# EAGLE design ALLtheOtherLEDs (EAGLE 5.09)
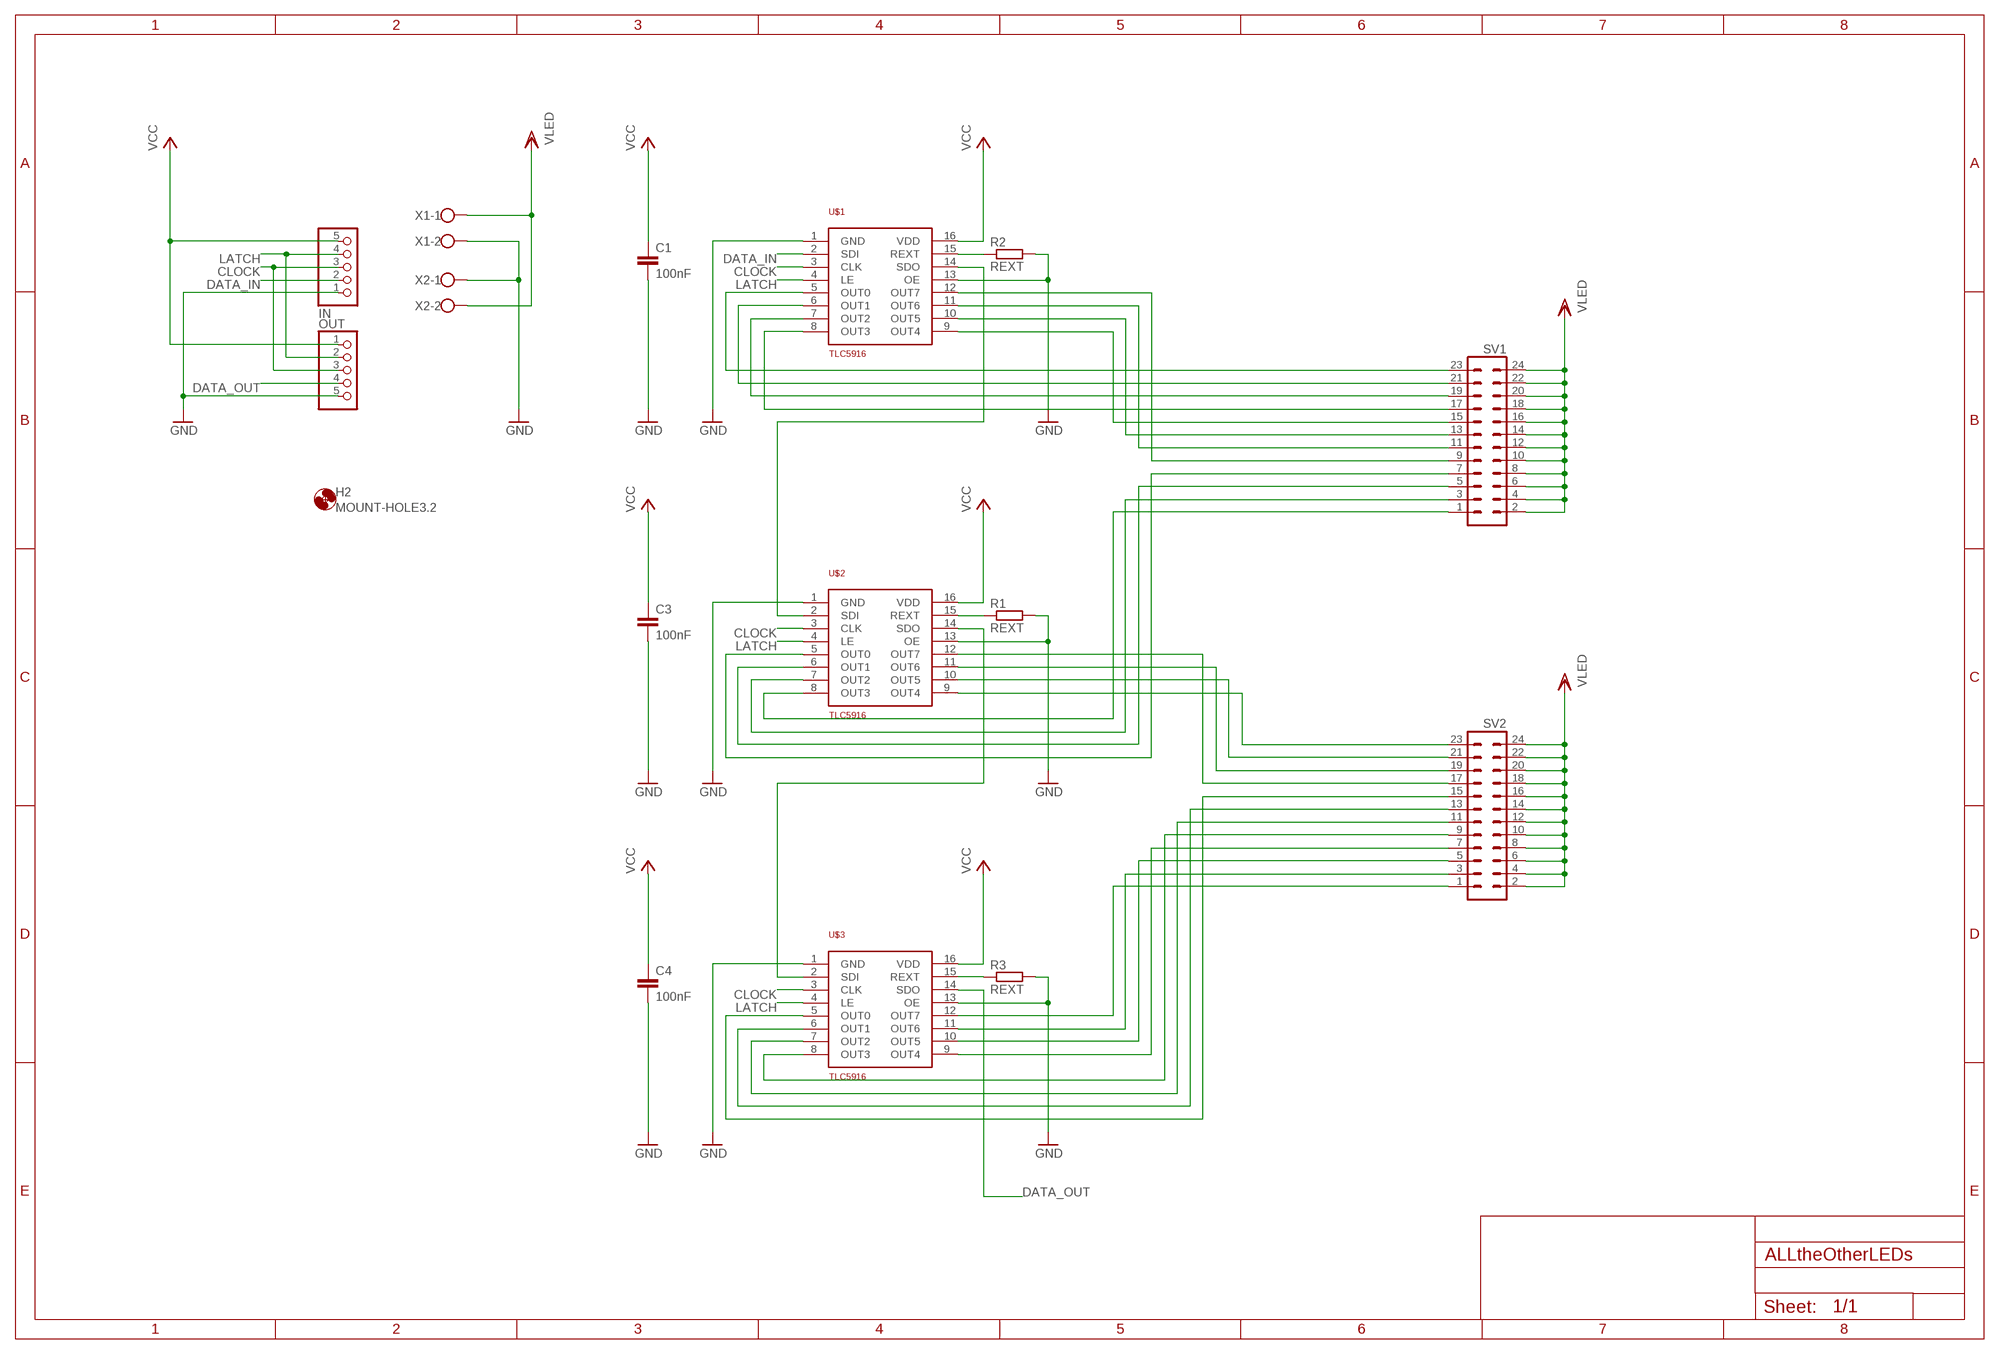
[diagram p0: schematic, sheet 1]

## Parts
C1  100nF  C-EU050-024X044  [C050-024X044]
C3  100nF  C-EU050-024X044  [C050-024X044]
C4  100nF  C-EU050-024X044  [C050-024X044]
H2  MOUNT-HOLE3.2  [3,2]
IN  PINHD-1X5/90  [1X05/90]
OUT  PINHD-1X5/90  [1X05/90]
R1  REXT  R-EU_0204/5  [0204/5]
R2  REXT  R-EU_0204/5  [0204/5]
R3  REXT  R-EU_0204/5  [0204/5]
SV1  MA12-2W  [MA12-2W]
SV2  MA12-2W  [MA12-2W]
U$1  TLC5916  [SO-16]
U$2  TLC5916  [SO-16]
U$3  TLC5916  [SO-16]
X1  W237-102  [W237-102]
X2  W237-102  [W237-102]

## Nets
CLOCK: IN.3 OUT.3 U$1.3(CLK) U$2.3(CLK) U$3.3(CLK)
DATA_IN: IN.2 U$1.2(SDI)
DATA_OUT: OUT.4 U$3.14(SDO)
GND: C1.2 C3.2 C4.2 IN.1 OUT.5 R1.2 R2.2 R3.2 U$1.1(GND) U$1.13(OE) U$2.1(GND) U$2.13(OE) U$3.1(GND) U$3.13(OE) X1.2 X2.1
LATCH: IN.4 OUT.2 U$1.4(LE) U$2.4(LE) U$3.4(LE)
N$1: U$2.14(SDO) U$3.2(SDI)
N$2: U$1.14(SDO) U$2.2(SDI)
N$4: R2.1 U$1.15(REXT)
N$5: R1.1 U$2.15(REXT)
N$6: SV1.23 U$1.5(OUT0)
N$7: R3.1 U$3.15(REXT)
N$8: SV1.21 U$1.6(OUT1)
N$29: SV1.19 U$1.7(OUT2)
N$30: SV1.17 U$1.8(OUT3)
N$31: SV1.15 U$1.9(OUT4)
N$32: SV1.13 U$1.10(OUT5)
N$33: SV1.11 U$1.11(OUT6)
N$34: SV1.9 U$1.12(OUT7)
N$35: SV1.1 U$2.8(OUT3)
N$36: SV1.7 U$2.5(OUT0)
N$37: SV1.5 U$2.6(OUT1)
N$38: SV1.3 U$2.7(OUT2)
N$39: SV2.1 U$3.12(OUT7)
N$40: SV2.3 U$3.11(OUT6)
N$41: SV2.5 U$3.10(OUT5)
N$42: SV2.7 U$3.9(OUT4)
N$43: SV2.9 U$3.8(OUT3)
N$44: SV2.11 U$3.7(OUT2)
N$45: SV2.13 U$3.6(OUT1)
N$46: SV2.15 U$3.5(OUT0)
N$47: SV2.17 U$2.12(OUT7)
N$48: SV2.19 U$2.11(OUT6)
N$49: SV2.21 U$2.10(OUT5)
N$50: SV2.23 U$2.9(OUT4)
VCC: C1.1 C3.1 C4.1 IN.5 OUT.1 U$1.16(VDD) U$2.16(VDD) U$3.16(VDD)
VSS: SV1.2 SV1.4 SV1.6 SV1.8 SV1.10 SV1.12 SV1.14 SV1.16 SV1.18 SV1.20 SV1.22 SV1.24 SV2.2 SV2.4 SV2.6 SV2.8 SV2.10 SV2.12 SV2.14 SV2.16 SV2.18 SV2.20 SV2.22 SV2.24 X1.1 X2.2 ; supply symbol labelled VLED

## Library data of the parts
C1 C3 C4 = rcl:C-EU: CAPACITOR, European symbol
H2 = holes:MOUNT-HOLE: MOUNTING HOLE with drill center marker
IN OUT = pinhead:PINHD-1X5: PIN HEADER
R1-R3 = rcl:R-EU_: RESISTOR, European symbol
SV1 SV2 = con-lstb:MA12-2W: PIN HEADER
U$1-U$3 = texas:TLC5916
X1 X2 = con-wago-500:W237-102: WAGO SCREW CLAMP

## Board
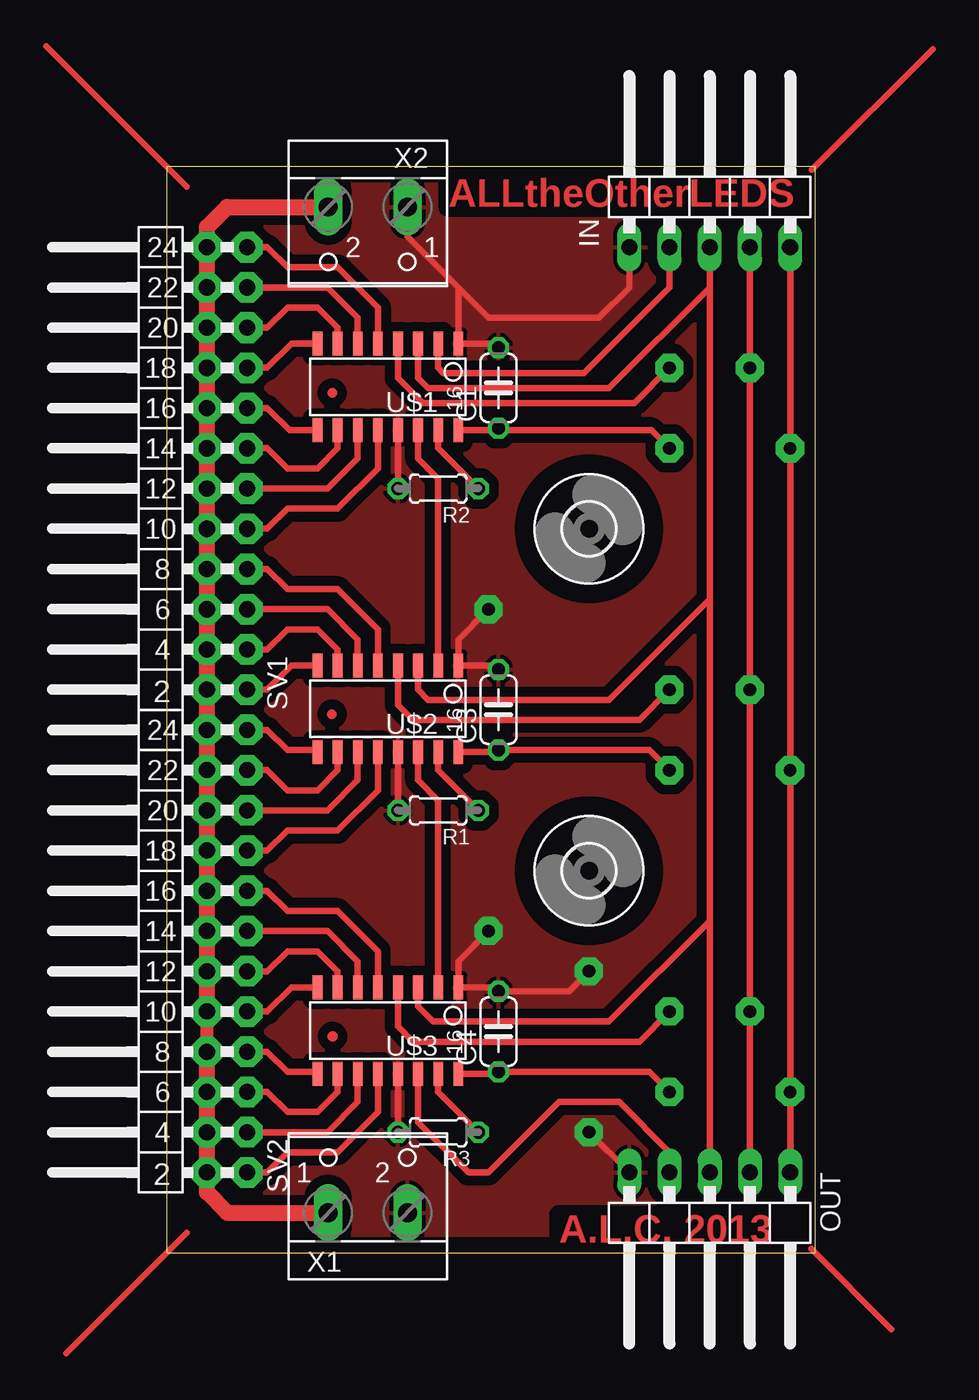
[diagram p1: board, top side]
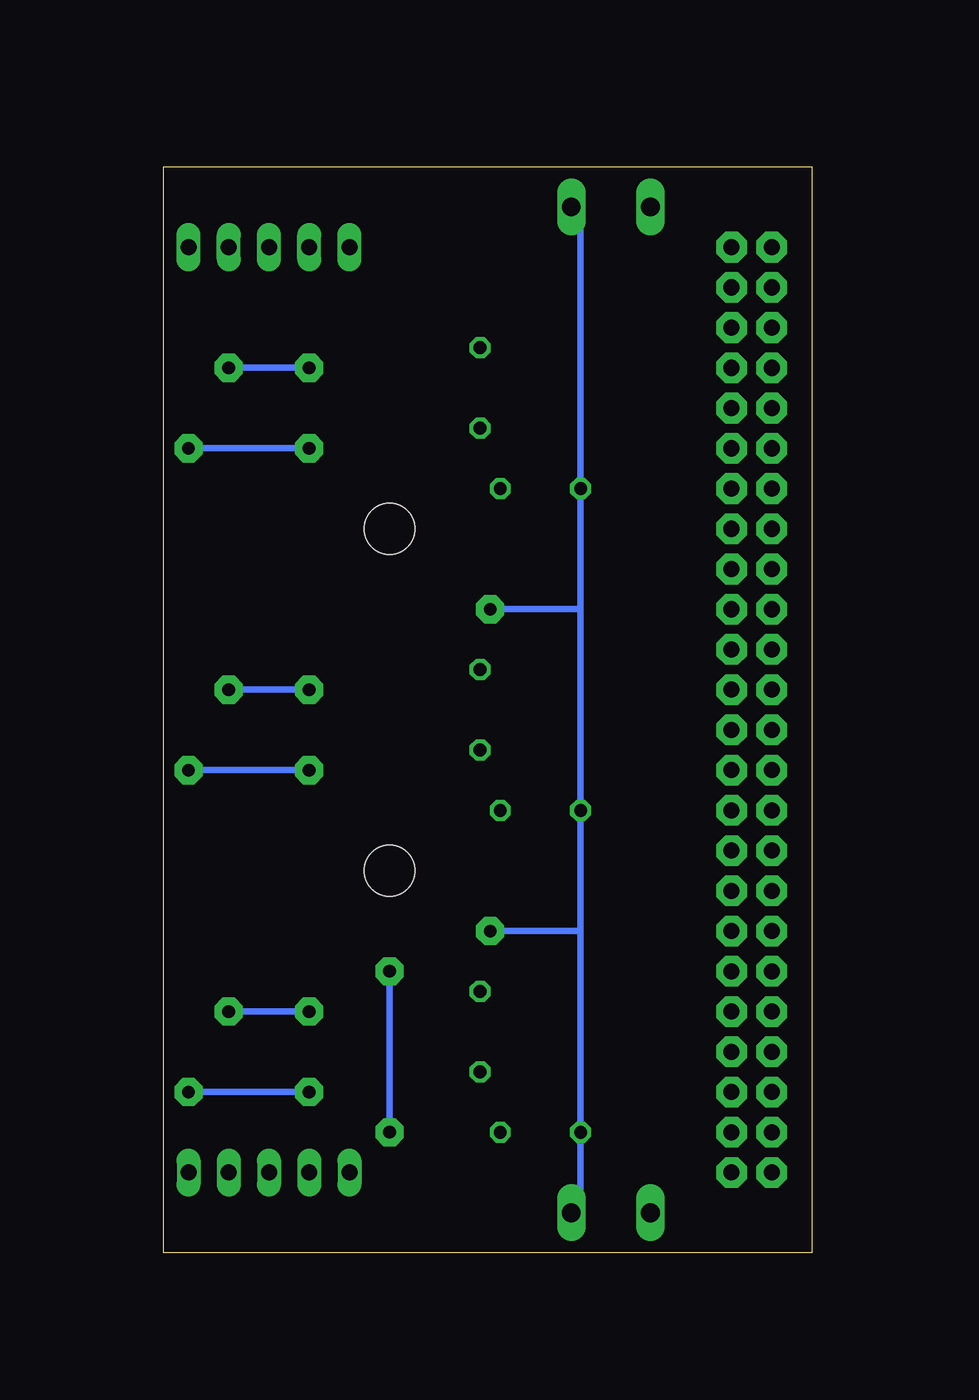
[diagram p2: board, bottom side, seen from below]

Size 40.95 x 68.57 mm. Coordinates in mm from the lower left corner, seen from the top.
Outline: 0,0 40.95,0 40.95,68.57 0,68.57 0,0
Copper layers (1*16): Top 0.035mm / dielectric 1.5mm / Bottom 0.035mm
Design rules "default": minimum track width 10mil, minimum drill 24mil, track to track 8mil, track to pad 8mil, pad to pad 8mil, via to via 8mil, smd to smd 8mil, copper to edge 40mil, drill to drill 8mil, minimum pad ring 10mil, minimum via ring 8mil, stop-mask expansion 4mil, vias tented up to drill 0mil, thermal gap 10mil

### Footprints (pad centres in the part's own frame; a part is rotated, then mirrored left to right if it is on the bottom)
C050-024X044 = drill 0.813 octagon: 1 -2.54,0; 2 2.54,0
3,2 = hole 3.2: 0,0
1X05/90 = drill 1.016 long: 1 -5.08,-3.81; 2 -2.54,-3.81; 3 0,-3.81; 4 2.54,-3.81; 5 5.08,-3.81
0204/5 = drill 0.813 octagon: 1 -2.54,0; 2 2.54,0
MA12-2W = drill 1.016 pad 1.93 octagon: 1 -13.97,-1.27; 2 -13.97,1.27; 3 -11.43,-1.27; 4 -11.43,1.27; 5 -8.89,-1.27; 6 -8.89,1.27; 7 -6.35,-1.27; 8 -6.35,1.27; 9 -3.81,-1.27; 10 -3.81,1.27; 11 -1.27,-1.27; 12 -1.27,1.27; 13 1.27,-1.27; 14 1.27,1.27; 15 3.81,-1.27; 16 3.81,1.27; 17 6.35,-1.27; 18 6.35,1.27; 19 8.89,-1.27; 20 8.89,1.27; 21 11.43,-1.27; 22 11.43,1.27; 23 13.97,-1.27; 24 13.97,1.27
SO-16 = smd 0.61 x 1.524: 1 -4.445,-2.794; 2 -3.175,-2.794; 3 -1.905,-2.794; 4 -0.635,-2.794; 5 0.635,-2.794; 6 1.905,-2.794; 7 3.175,-2.794; 8 4.445,-2.794; 9 4.445,2.667; 10 3.175,2.667; 11 1.905,2.667; 12 0.635,2.667; 13 -0.635,2.667; 14 -1.905,2.667; 15 -3.175,2.667; 16 -4.445,2.667
W237-102 = drill 1.194 long: 1 -2.5,-1.27; 2 2.5,-1.27

### Placement (x,y rotation side)
C1  20.95,54.61 90 top
C3  20.95,34.29 90 top
C4  20.95,13.97 90 top
H1  MOUNT-HOLE3.2  [3,2]  26.67,24.13 0 top
H2  26.67,45.72 0 top
IN  34.29,67.31 0 top
OUT  34.29,1.27 180 top
R1  17.14,27.94 180 top
R2  17.14,48.26 180 top
R3  17.14,7.62 180 top
SV1  3.81,49.53 90 top
SV2  3.81,19.05 90 top
U$1  13.97,54.61 180 top
U$2  13.97,34.29 180 top
U$3  13.97,13.97 180 top
X1  12.7,3.81 0 top
X2  12.7,64.77 180 top

### Tracks (layer width: path | path; a pad name or v marks a point on that pad's centre or on a via)
CLOCK
  Top 0.406: 34.29,20.95 OUT.3 34.29,3.81 | 34.29,20.95 34.29,41.27 | 34.29,41.27 34.29,60.96 | 34.29,60.96 IN.3 | U$1.3 15.88,55.24 16.51,54.61 27.94,54.61 34.29,60.96 | U$2.3 15.88,35.56 16.51,34.92 27.94,34.92 34.29,41.27 | U$3.3 15.88,15.56 16.83,14.61 27.94,14.61 34.29,20.95
DATA_IN
  Top 0.406: U$1.2 17.14,55.88 17.46,55.56 26.35,55.56 31.75,60.96 IN.2
DATA_OUT
  Top 0.406: U$3.14 15.88,8.26 19.05,5.08 20.32,5.08 24.77,9.53 28.57,9.53 31.75,6.35 OUT.4
GND  (via drill 0.8 pad 1.78)
  Top 0.406: 29.21,5.5 OUT.5 v26.67,7.62 | X2.1 15.2,64.17 18.41,60.96 | 18.41,60.96 U$1.1 20.7,57.4 C1.2 | R2.2 U$1.13 | R1.2 U$2.13 | R3.2 U$3.13 | 18.41,60.96 20.32,59.05 27.3,59.05 29.21,60.96 IN.1 | C3.2 20.7,37.08 U$2.1 18.41,38.73 v20.32,40.64 | v26.67,17.78 25.4,16.51 C4.2 20.7,16.76 U$3.1 18.41,18.41 v20.32,20.32
  Bottom 0.406: X2.1 14.61,65.44 R2.2 14.61,40.64 | 14.61,40.64 R1.2 14.61,20.32 | 14.61,20.32 R3.2 14.61,3.13 X1.2 | v26.67,17.78 v26.67,7.62 | 14.61,40.64 v20.32,40.64 | 14.61,20.32 v20.32,20.32
  pour Top (isolate 0.61): 0,68.58 40.64,68.58 40.64,0 0,0
LATCH  (via drill 0.8 pad 1.78)
  Top 0.406: U$1.4 14.61,55.24 16.19,53.66 29.53,53.66 v31.75,55.88 | OUT.2 v36.83,15.24 36.83,17.78 v36.83,35.56 v36.83,55.88 IN.4 | U$2.4 14.61,34.61 15.56,33.66 29.84,33.66 v31.75,35.56 | U$3.4 14.61,14.29 15.56,13.34 29.84,13.34 v31.75,15.24
  Bottom 0.406: v36.83,55.88 v31.75,55.88 | v36.83,35.56 v31.75,35.56 | v31.75,15.24 v36.83,15.24
N$1
  Top 0.406: U$2.14 15.88,29.84 17.14,28.57 U$3.2
N$2
  Top 0.406: U$1.14 15.88,50.16 17.14,48.9 U$2.2
N$3  (via drill 0.6)
  other vias: 26.67,24.13
N$4
  Top 0.406: U$1.15 17.14,50.8 R2.1
N$5
  Top 0.406: U$2.15 17.14,30.48 R1.1
N$6
  Top 0.406: SV1.23 6.35,63.5 7.62,62.23 10.79,62.23 13.34,59.69 U$1.5
N$7
  Top 0.406: U$3.15 17.14,10.16 R3.1
N$8
  Top 0.406: U$1.6 12.06,59.05 10.16,60.96 SV1.21
N$29
  Top 0.406: SV1.19 6.35,58.42 7.62,59.69 9.53,59.69 10.79,58.42 U$1.7
N$30
  Top 0.406: U$1.8 7.87,57.4 6.35,55.88 SV1.17
N$31
  Top 0.406: U$1.9 7.75,51.94 6.35,53.34 SV1.15
N$32
  Top 0.406: U$1.10 10.79,50.8 9.53,49.53 7.62,49.53 6.35,50.8 SV1.13
N$33
  Top 0.406: U$1.11 12.06,50.16 10.16,48.26 SV1.11
N$34
  Top 0.406: 5.71,45.72 SV1.9 6.35,45.72 7.62,46.99 10.79,46.99 13.34,49.53 U$1.12
N$35
  Top 0.406: U$2.8 7.87,37.08 6.35,35.56 SV1.1
N$36
  Top 0.406: SV1.7 6.35,43.18 7.62,41.91 10.79,41.91 13.34,39.37 U$2.5
N$37
  Top 0.406: U$2.6 12.06,38.73 10.16,40.64 SV1.5
N$38
  Top 0.406: U$2.7 10.79,38.1 9.53,39.37 7.62,39.37 6.35,38.1 SV1.3
N$39
  Top 0.406: SV2.1 6.35,5.08 7.62,6.35 10.79,6.35 13.34,8.89 U$3.12
N$40
  Top 0.406: U$3.11 12.06,9.53 10.16,7.62 SV2.3
N$41
  Top 0.406: SV2.5 6.35,10.16 7.62,8.89 9.53,8.89 10.79,10.16 U$3.10
N$42
  Top 0.406: SV2.7 6.35,12.7 7.62,11.43 9.4,11.43 U$3.9
N$43
  Top 0.406: U$3.8 7.87,16.76 6.35,15.24 SV2.9
N$44
  Top 0.406: SV2.11 6.35,17.78 7.62,19.05 9.53,19.05 10.79,17.78 U$3.7
N$45
  Top 0.406: SV2.13 10.16,20.32 12.06,18.41 U$3.6
N$46
  Top 0.406: SV2.15 6.35,22.86 7.62,21.59 10.79,21.59 13.34,19.05 U$3.5
N$47
  Top 0.406: SV2.17 6.35,25.4 7.62,26.67 10.79,26.67 13.34,29.21 U$2.12
N$48
  Top 0.406: SV2.19 10.16,27.94 12.06,29.84 U$2.11
N$49
  Top 0.406: SV2.21 6.35,30.48 7.62,29.21 9.53,29.21 10.79,30.48 U$2.10
N$50
  Top 0.406: SV2.23 6.35,33.02 7.62,31.75 9.4,31.75 U$2.9
N$52  (via drill 0.6)
  other vias: 26.67,45.72
N$53
  Top 0.406: 1.27,67.31 -7.62,76.2
N$54
  Top 0.406: 40.75,68.39 48.37,76
N$55
  Top 0.406: 1.27,1.27 -6.35,-6.35
N$56
  Top 0.406: 40.69,0.25 45.77,-4.83
VCC  (via drill 0.8 pad 1.78)
  Top 0.406: OUT.1 v39.37,10.16 v39.37,30.48 v39.37,50.8 IN.5 | 20.83,51.94 U$1.16 | 20.83,51.94 C1.1 | U$2.16 20.83,31.62 C3.1 30.48,31.75 v31.75,30.48 | U$3.16 20.83,11.3 C4.1 30.48,11.43 v31.75,10.16 | 20.83,51.94 30.61,51.94 v31.75,50.8
  Bottom 0.406: v39.37,50.8 v31.75,50.8 | v39.37,30.48 v31.75,30.48 | v31.75,10.16 v39.37,10.16
VSS
  Top 0.813: SV2.8 SV2.10
  Top 1.016: SV2.10 SV2.12 SV2.14 SV2.16 SV2.18 SV2.20 SV2.22 SV2.24 SV1.2 SV1.4 SV1.6 SV1.8 SV1.10 SV1.12 SV1.14 SV1.16 SV1.18 SV1.20 SV1.22 SV1.24 2.54,64.77 3.81,66.04 X2.2 | SV2.8 SV2.6 SV2.4 SV2.2 2.54,3.81 3.81,2.54 X1.1
(copper drawn outside any net)
  shapes: Top circle x3

### Text on the board
Top: ALLtheOtherLEDS | A.L.C. 2013